# Altium schematic sheet Sayma_AMC.SchDoc: Sayma AMC
size 420 x 297 mm; $$Internal___BlkDate: 0:12:25_2-9-18; $$Internal_NAME_PLACEHOLDER: a3sheet; $$Internal_Resolution: 00001mm; $$NotCommonProperty_@NAME: Sayma_AMC; $$NotCommonProperty_@PRINTORDER: 1; $$NotCommonProperty_@SHEET: 1; $$NotCommonProperty_@SHEETTOTAL: 30; $$NotCommonProperty_FORWARD_PCB: 0; CmpIndex: 8; Drawing Author: G.Kasprowicz; Drawing Number: Sayma AMC; Drawing Project: AMC FMC Carrier Board; Drawing Revision: 2.0; SymIndex: 2141; CheckedBy: P.Kulik,T.Przywozki,W.Ruclo; Author: G.Kasprowicz; CompanyName: WUT ISE; DrawnBy: G.Kasprowicz; Organization: WUT ISE; Address1: PW ISE; Address2: Nowowiejska 15/19 00-665 Warsaw; Address3: gkasprow@gmail.com; DocumentNumber: 1; Revision: 2; SheetNumber: 1; SheetTotal: 32; ModifiedBy: -; CheckedDate: -; Title2: Top; DivGrp: WUT ISE; Designer: G.Kasprowicz; ModifiedDate: -; ProjectName: Sensor Box
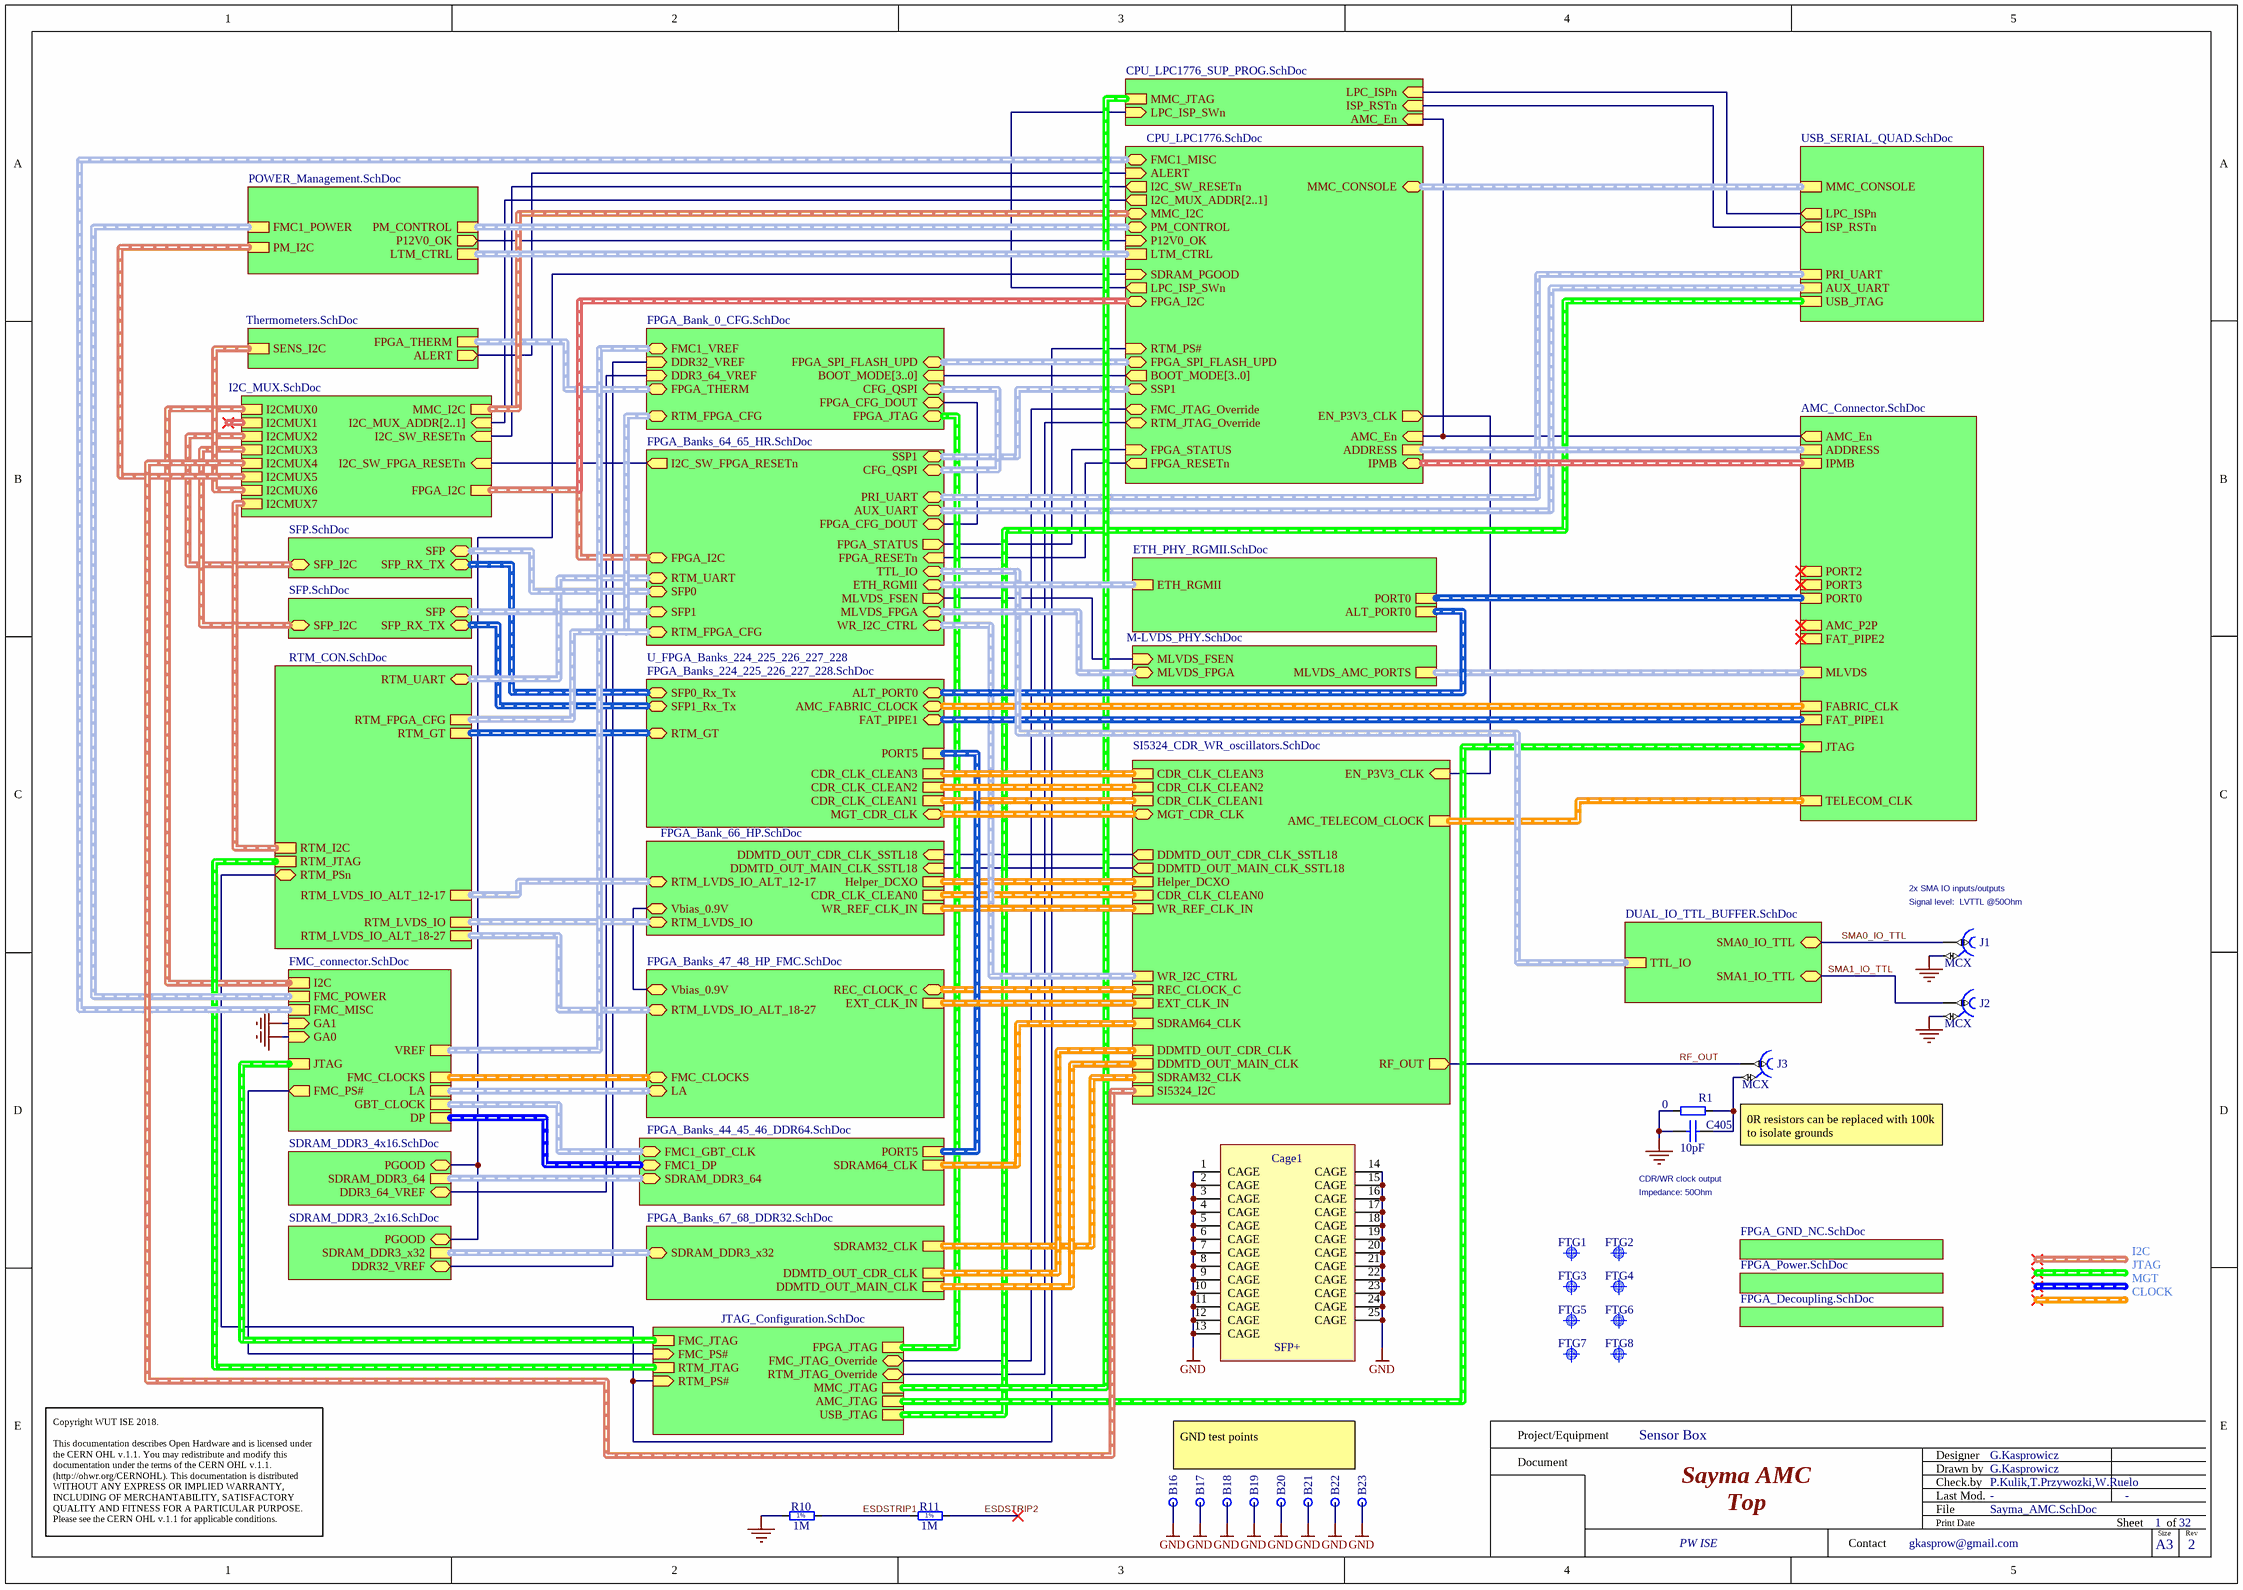
[diagram p0: Sayma_AMC.SchDoc]

## Parts
B16  Plated Hole  [c130h80]  (value not drawn)  (no BOM)
B17  Plated Hole  [c130h80]  (value not drawn)  (no BOM)
B18  Plated Hole  [c130h80]  (value not drawn)  (no BOM)
B19  Plated Hole  [c130h80]  (value not drawn)  (no BOM)
B20  Plated Hole  [c130h80]  (value not drawn)  (no BOM)
B21  Plated Hole  [c130h80]  (value not drawn)  (no BOM)
B22  Plated Hole  [c130h80]  (value not drawn)  (no BOM)
B23  Plated Hole  [c130h80]  (value not drawn)  (no BOM)
C405  10pF  [CAPC1608X87N]
Cage1  SFP+  [TYCO_2007263-1]
FTG1  Use only in PCB  [FIDUCIAL_TOP_C100-200]  (value not drawn)
FTG2  Use only in PCB  [FIDUCIAL_TOP_S100-200]  (value not drawn)
FTG3  Use only in PCB  [FIDUCIAL_TOP_C100-200]  (value not drawn)
FTG4  Use only in PCB  [FIDUCIAL_TOP_S100-200]  (value not drawn)
FTG5  Use only in PCB  [FIDUCIAL_TOP_C100-200]  (value not drawn)
FTG6  Use only in PCB  [FIDUCIAL_TOP_S100-200]  (value not drawn)
FTG7  Use only in PCB  [FIDUCIAL_TOP_C100-200]  (value not drawn)
FTG8  Use only in PCB  [FIDUCIAL_TOP_S100-200]  (value not drawn)
J1  MCX  [AMPHENOL_ARF2521-ND]
J2  MCX  [AMPHENOL_ARF2521-ND]
J3  MCX  [AMPHENOL_ARF2521-ND]
R1  0  [RESC1005X40N]
R10  1M  [RESC5025X65N]
R11  1M  [RESC5025X65N]

## Sub-sheets
AMC_Connector = AMC_Connector.SchDoc: ADDRESS (harness AMC_ADD), IPMB (harness I2C), PORT0 (harness MGTx1), FABRIC_CLK (harness AMC_FABRIC_CLOCK), TELECOM_CLK (harness AMC_TELECOM_CLOCK), AMC_P2P (harness AMC_P2P), FAT_PIPE1 (harness FAT_PIPE1), FAT_PIPE2 (harness FAT_PIPE2), MLVDS (harness MLVDS), JTAG (harness JTAG), PORT3 (harness PORT3), PORT2 (harness PORT2), AMC_En (out)  | $$NotCommonProperty_SHEETNAME: AMC_CON; CmpIndex: 1; Name: AMC_CON74792; SymIndex: 791
CPU_LPC1776 = CPU_LPC1776.SchDoc: RTM_PS# (in), ALERT (in), FMC1_MISC (bidir, harness FMC_MICS), FPGA_I2C (bidir, harness I2C), IPMB (bidir, harness I2C), FPGA_SPI_FLASH_UPD (bidir, harness FLASH_UPD), FPGA_RESETn (out), LPC_ISP_SWn (out), SDRAM_PGOOD (in), MMC_CONSOLE (bidir, harness UART), ADDRESS (harness AMC_ADD), MMC_I2C (bidir, harness I2C), AMC_En (in), PM_CONTROL (bidir, harness PM_CONTROL), I2C_SW_RESETn (out), I2C_MUX_ADDR[2..1] (out), P12V0_OK (in), BOOT_MODE[3..0] (out), FMC_JTAG_Override (bidir), RTM_JTAG_Override (bidir), SSP1 (bidir, harness SPI), FPGA_STATUS (in), LTM_CTRL (harness LTM_CTRL), EN_P3V3_CLK (out)  | CmpIndex: 54; Name: LPC17762984; SymIndex: 1756
DUAL_IO_TTL_BUFFER = DUAL_IO_TTL_BUFFER.SchDoc: SMA0_IO_TTL (bidir), SMA1_IO_TTL (bidir), TTL_IO (harness TTL_IO)  | CmpIndex: 71; Name: DUAL_IO_TTL_BUFFER; SymIndex: 1772
ETH_PHY_RGMII = ETH_PHY_RGMII.SchDoc: ETH_RGMII (harness RGMII), PORT0 (harness MGTx1), ALT_PORT0 (harness MGTx1)  | CmpIndex: 18; SymIndex: 1511
FMC_connector = FMC_connector.SchDoc: FMC_CLOCKS (harness FMC_CLOCKS), GBT_CLOCK (harness DIFF_CLK), VREF (harness FMC_VREF), JTAG (harness JTAG), GA0 (in), FMC_POWER (harness FMC_POWER), GA1 (in), LA (harness FMC_LA), DP (harness DP0), FMC_MISC (harness FMC_MICS), I2C (harness I2C), FMC_PS# (out)  | $$NotCommonProperty_SHEETNAME: HPC1; CmpIndex: 6; Name: FMC1; SymIndex: 792
I2C_MUX = I2C_MUX.SchDoc: FPGA_I2C (harness I2C), MMC_I2C (harness I2C), I2CMUX7 (harness I2C), I2CMUX6 (harness I2C), I2CMUX5 (harness I2C), I2CMUX3 (harness I2C), I2CMUX2 (harness I2C), I2CMUX1 (harness I2C), I2CMUX0 (harness I2C), I2C_SW_RESETn (in), I2CMUX4 (harness I2C), I2C_MUX_ADDR[2..1] (in), I2C_SW_FPGA_RESETn (in)  | CmpIndex: 23; Name: I2C_MUX; SymIndex: 1875
JTAG_Configuration = JTAG_Configuration.SchDoc: FMC_JTAG (harness JTAG), AMC_JTAG (harness JTAG), FPGA_JTAG (harness JTAG4), MMC_JTAG (harness JTAG), RTM_JTAG (harness JTAG4), USB_JTAG (harness USB_JTAG), FMC_PS# (in), RTM_PS# (in), RTM_JTAG_Override (bidir), FMC_JTAG_Override (bidir)  | $$NotCommonProperty_SHEETNAME: JTAG_CONF; CmpIndex: 3; Name: JTAG_CONF7; SymIndex: 798
M-LVDS_PHY = M-LVDS_PHY.SchDoc: MLVDS_AMC_PORTS (harness MLVDS), MLVDS_FPGA (bidir, harness MLVDS_FPGA), MLVDS_FSEN (in)  | $$NotCommonProperty_SHEETNAME: LVDS_PHY; CmpIndex: 29; Name: AMC_FMC_Carrier_LVDS_PHY762107; SymIndex: 800
POWER_Management = POWER_Management.SchDoc: FMC1_POWER (harness FMC_POWER), PM_CONTROL (harness PM_CONTROL), PM_I2C (harness I2C), P12V0_OK (out), LTM_CTRL (harness LTM_CTRL)  | $$NotCommonProperty_SHEETNAME: PWR_MGT; CmpIndex: 13; Name: PWR_MGT75095; SymIndex: 796
RTM_CON = RTM_CON.SchDoc: RTM_GT (harness RTM_GT), RTM_I2C (harness I2C), RTM_PSn (bidir), RTM_JTAG (harness JTAG4), RTM_FPGA_CFG (harness RTM_FPA_CFG), RTM_LVDS_IO (harness RTM_LVDS_IO), RTM_LVDS_IO_ALT_18-27 (harness RTM_LVDS_IO_ALT_18-27), RTM_LVDS_IO_ALT_12-17 (harness RTM_LVDS_IO_ALT_12-17), RTM_UART (bidir, harness UART)  | $$NotCommonProperty_SHEETNAME: RTM_CON; CmpIndex: 15; Name: RTM_CON; SymIndex: 799
SDRAM_DDR3_2x16 = SDRAM_DDR3_2x16.SchDoc: PGOOD (bidir), SDRAM_DDR3_x32 (harness DDR3_32), DDR32_VREF (bidir)  | CmpIndex: 9; SymIndex: 1420
SDRAM_DDR3_4x16 = SDRAM_DDR3_4x16.SchDoc: PGOOD (bidir), SDRAM_DDR3_64 (harness SDRAM_DDR3_64), DDR3_64_VREF (bidir)  | CmpIndex: 2; SymIndex: 276
SFP = SFP.SchDoc: SFP (bidir, harness SFP_CTL), SFP_RX_TX (bidir, harness SFP_MGT), SFP_I2C (bidir, harness I2C)  | CmpIndex: 17; SymIndex: 1422
SFP = SFP.SchDoc: SFP (bidir, harness SFP_CTL), SFP_RX_TX (bidir, harness SFP_MGT), SFP_I2C (bidir, harness I2C)  | CmpIndex: 17; SymIndex: 1422
SI5324_CDR_WR_oscillators = SI5324_CDR_WR_oscillators.SchDoc: CDR_CLK_CLEAN1 (harness DIFF_CLK), WR_REF_CLK_IN (harness DIFF_CLK), CDR_CLK_CLEAN0 (harness DIFF_CLK), Helper_DCXO (harness DIFF_CLK), REC_CLOCK_C (harness DIFF_CLK), AMC_TELECOM_CLOCK (harness AMC_TELECOM_CLOCK), WR_I2C_CTRL (harness WR_I2C_CTRL), SI5324_I2C (harness I2C), RF_OUT (out), SDRAM64_CLK (harness DIFF_CLK), SDRAM32_CLK (harness DIFF_CLK), CDR_CLK_CLEAN2 (harness DIFF_CLK), CDR_CLK_CLEAN3 (harness DIFF_CLK), MGT_CDR_CLK (bidir, harness DIFF_CLK), DDMTD_OUT_CDR_CLK (harness DIFF_CLK), DDMTD_OUT_MAIN_CLK (harness DIFF_CLK), EXT_CLK_IN (harness DIFF_CLK), DDMTD_OUT_CDR_CLK_SSTL18 (out), DDMTD_OUT_MAIN_CLK_SSTL18 (out), EN_P3V3_CLK (in)  | CmpIndex: 22; Name: Si5324 Clock recovery945991223; SymIndex: 1416
Thermometers = Thermometers.SchDoc: ALERT (out), FPGA_THERM (harness FPGA_THERM), SENS_I2C (harness I2C)  | $$NotCommonProperty_SHEETNAME: THERMO; CmpIndex: 44; Name: FMC_HPC2_THERMO; SymIndex: 789
U_CPU_LPC1776_SUP_PROG = CPU_LPC1776_SUP_PROG.SchDoc: LPC_ISPn (in), ISP_RSTn (in), LPC_ISP_SWn (in), MMC_JTAG (harness JTAG), AMC_En (in)
U_FPGA_Bank_0_CFG = FPGA_Bank_0_CFG.SchDoc: FMC1_VREF (bidir, harness FMC_VREF), FPGA_JTAG (bidir, harness JTAG4), BOOT_MODE[3..0] (in), FPGA_SPI_FLASH_UPD (bidir, harness FLASH_UPD), DDR32_VREF (in), DDR3_64_VREF (in), CFG_QSPI (bidir, harness CFG_QSPI), RTM_FPGA_CFG (bidir, harness RTM_FPA_CFG), FPGA_CFG_DOUT (bidir), FPGA_THERM (bidir, harness FPGA_THERM)
U_FPGA_Bank_66_HP = FPGA_Bank_66_HP.SchDoc: RTM_LVDS_IO_ALT_12-17 (bidir, harness RTM_LVDS_IO_ALT_12-17), RTM_LVDS_IO (bidir, harness RTM_LVDS_IO), Helper_DCXO (harness DIFF_CLK), CDR_CLK_CLEAN0 (harness DIFF_CLK), WR_REF_CLK_IN (harness DIFF_CLK), Vbias_0.9V (bidir), DDMTD_OUT_CDR_CLK_SSTL18 (in), DDMTD_OUT_MAIN_CLK_SSTL18 (in)
U_FPGA_Banks_44_45_46_DDR64 = FPGA_Banks_44_45_46_DDR64.SchDoc: FMC1_GBT_CLK (bidir, harness DIFF_CLK), FMC1_DP (bidir, harness DP0), SDRAM_DDR3_64 (bidir, harness SDRAM_DDR3_64), PORT5 (harness MGTx1), SDRAM64_CLK (harness DIFF_CLK)
U_FPGA_Banks_47_48_HP_FMC = FPGA_Banks_47_48_HP_FMC.SchDoc: RTM_LVDS_IO_ALT_18-27 (bidir, harness RTM_LVDS_IO_ALT_18-27), LA (bidir, harness FMC_LA), FMC_CLOCKS (bidir, harness FMC_CLOCKS), REC_CLOCK_C (bidir, harness DIFF_CLK), Vbias_0.9V (bidir), EXT_CLK_IN (harness DIFF_CLK)
U_FPGA_Banks_64_65_HR = FPGA_Banks_64_65_HR.SchDoc: SFP1 (bidir, harness SFP_CTL), SFP0 (bidir, harness SFP_CTL), FPGA_RESETn (in), MLVDS_FSEN (out), ETH_RGMII (bidir, harness RGMII), WR_I2C_CTRL (bidir, harness WR_I2C_CTRL), MLVDS_FPGA (bidir, harness MLVDS_FPGA), FPGA_I2C (bidir, harness I2C), FPGA_STATUS (out), SSP1 (bidir, harness SPI), CFG_QSPI (bidir, harness CFG_QSPI), RTM_FPGA_CFG (bidir, harness RTM_FPA_CFG), FPGA_CFG_DOUT (bidir), TTL_IO (bidir, harness TTL_IO), RTM_UART (bidir, harness UART), PRI_UART (bidir, harness UART), AUX_UART (bidir, harness UART), I2C_SW_FPGA_RESETn (out)
U_FPGA_Banks_67_68_DDR32 = FPGA_Banks_67_68_DDR32.SchDoc: SDRAM_DDR3_x32 (bidir, harness DDR3_32), SDRAM32_CLK (harness DIFF_CLK), DDMTD_OUT_CDR_CLK (harness DIFF_CLK), DDMTD_OUT_MAIN_CLK (harness DIFF_CLK)
U_FPGA_Banks_224_225_226_227_228 = FPGA_Banks_224_225_226_227_228.SchDoc: SFP0_Rx_Tx (bidir, harness SFP_MGT), SFP1_Rx_Tx (bidir, harness SFP_MGT), FAT_PIPE1 (bidir, harness FAT_PIPE1), AMC_FABRIC_CLOCK (bidir, harness AMC_FABRIC_CLOCK), ALT_PORT0 (bidir, harness MGTx1), RTM_GT (bidir, harness RTM_GT), CDR_CLK_CLEAN1 (harness DIFF_CLK), PORT5 (harness MGTx1), CDR_CLK_CLEAN2 (harness DIFF_CLK), CDR_CLK_CLEAN3 (harness DIFF_CLK), MGT_CDR_CLK (bidir, harness DIFF_CLK)
U_FPGA_Decoupling = FPGA_Decoupling.SchDoc: no entries
U_FPGA_GND_NC = FPGA_GND_NC.SchDoc: no entries
U_FPGA_Power = FPGA_Power.SchDoc: no entries
USB_SERIAL_QUAD = USB_SERIAL_QUAD.SchDoc: MMC_CONSOLE (harness UART), USB_JTAG (harness USB_JTAG), LPC_ISPn (out), PRI_UART (harness UART), ISP_RSTn (out), AUX_UART (harness UART)  | CmpIndex: 0; Name: USB_UART_QUAD856120; SymIndex: 807

## Nets
GND: B16.1 B17.1 B18.1 B19.1 B20.1 B21.1 B22.1 B23.1 C405.1 Cage1.1(CAGE) Cage1.2(CAGE) Cage1.3(CAGE) Cage1.4(CAGE) Cage1.5(CAGE) Cage1.6(CAGE) Cage1.7(CAGE) Cage1.8(CAGE) Cage1.9(CAGE) Cage1.10(CAGE) Cage1.11(CAGE) Cage1.12(CAGE) Cage1.13(CAGE) Cage1.14(CAGE) Cage1.15(CAGE) Cage1.16(CAGE) Cage1.17(CAGE) Cage1.18(CAGE) Cage1.19(CAGE) Cage1.20(CAGE) Cage1.21(CAGE) Cage1.22(CAGE) Cage1.23(CAGE) Cage1.24(CAGE) Cage1.25(CAGE) J1.2 J2.2 R1.2 R10.1 ; sheet FMC_connector/GA0, sheet FMC_connector/GA1
ESDSTRIP1: R10.2 R11.1
ESDSTRIP2: R11.2
RF_OUT: J3.1 ; sheet SI5324_CDR_WR_oscillators/RF_OUT
SMA0_IO_TTL: J1.1 ; sheet DUAL_IO_TTL_BUFFER/SMA0_IO_TTL
SMA1_IO_TTL: J2.1 ; sheet DUAL_IO_TTL_BUFFER/SMA1_IO_TTL
NetC405_2: C405.2 J3.2 R1.1
(unnamed): sheet USB_SERIAL_QUAD/LPC_ISPn, sheet U_CPU_LPC1776_SUP_PROG/LPC_ISPn
(unnamed): sheet USB_SERIAL_QUAD/ISP_RSTn, sheet U_CPU_LPC1776_SUP_PROG/ISP_RSTn
(unnamed): sheet AMC_Connector/AMC_En, sheet CPU_LPC1776/AMC_En, sheet U_CPU_LPC1776_SUP_PROG/AMC_En
(unnamed): sheet SDRAM_DDR3_4x16/PGOOD, sheet SDRAM_DDR3_2x16/PGOOD, sheet CPU_LPC1776/SDRAM_PGOOD
(unnamed): sheet SDRAM_DDR3_4x16/DDR3_64_VREF, sheet U_FPGA_Bank_0_CFG/DDR3_64_VREF
(unnamed): sheet JTAG_Configuration/FMC_PS#, sheet FMC_connector/FMC_PS#
(unnamed): sheet JTAG_Configuration/RTM_PS#, sheet RTM_CON/RTM_PSn, sheet CPU_LPC1776/RTM_PS#
(unnamed): sheet JTAG_Configuration/RTM_JTAG_Override, sheet CPU_LPC1776/RTM_JTAG_Override
(unnamed): sheet JTAG_Configuration/FMC_JTAG_Override, sheet CPU_LPC1776/FMC_JTAG_Override
(unnamed): sheet SDRAM_DDR3_2x16/DDR32_VREF, sheet U_FPGA_Bank_0_CFG/DDR32_VREF
(unnamed): sheet POWER_Management/P12V0_OK, sheet CPU_LPC1776/P12V0_OK
(unnamed): sheet SI5324_CDR_WR_oscillators/DDMTD_OUT_CDR_CLK_SSTL18, sheet U_FPGA_Bank_66_HP/DDMTD_OUT_CDR_CLK_SSTL18
(unnamed): sheet SI5324_CDR_WR_oscillators/DDMTD_OUT_MAIN_CLK_SSTL18, sheet U_FPGA_Bank_66_HP/DDMTD_OUT_MAIN_CLK_SSTL18
(unnamed): sheet SI5324_CDR_WR_oscillators/EN_P3V3_CLK, sheet CPU_LPC1776/EN_P3V3_CLK
(unnamed): sheet I2C_MUX/I2C_SW_RESETn, sheet CPU_LPC1776/I2C_SW_RESETn
(unnamed): sheet I2C_MUX/I2C_SW_FPGA_RESETn, sheet U_FPGA_Banks_64_65_HR/I2C_SW_FPGA_RESETn
(unnamed): sheet Thermometers/ALERT, sheet CPU_LPC1776/ALERT
(unnamed): sheet CPU_LPC1776/FPGA_RESETn, sheet U_FPGA_Banks_64_65_HR/FPGA_RESETn
(unnamed): sheet CPU_LPC1776/LPC_ISP_SWn, sheet U_CPU_LPC1776_SUP_PROG/LPC_ISP_SWn
(unnamed): sheet CPU_LPC1776/FPGA_STATUS, sheet U_FPGA_Banks_64_65_HR/FPGA_STATUS
(unnamed): sheet U_FPGA_Banks_47_48_HP_FMC/Vbias_0.9V, sheet U_FPGA_Bank_66_HP/Vbias_0.9V
(unnamed): sheet U_FPGA_Banks_64_65_HR/MLVDS_FSEN, sheet M-LVDS_PHY/MLVDS_FSEN
(unnamed): sheet U_FPGA_Banks_64_65_HR/FPGA_CFG_DOUT, sheet U_FPGA_Bank_0_CFG/FPGA_CFG_DOUT

## Buses and harness runs
bus sheet CPU_LPC1776/BOOT_MODE[3..0] = sheet U_FPGA_Bank_0_CFG/BOOT_MODE[3..0]
bus sheet CPU_LPC1776/I2C_MUX_ADDR[2..1] = sheet I2C_MUX/I2C_MUX_ADDR[2..1]
harness sheet AMC_Connector/ADDRESS = sheet CPU_LPC1776/ADDRESS
harness sheet AMC_Connector/FABRIC_CLK = sheet U_FPGA_Banks_224_225_226_227_228/AMC_FABRIC_CLOCK
harness sheet AMC_Connector/FAT_PIPE1 = sheet U_FPGA_Banks_224_225_226_227_228/FAT_PIPE1
harness sheet AMC_Connector/IPMB = sheet CPU_LPC1776/IPMB
harness sheet AMC_Connector/JTAG = sheet JTAG_Configuration/AMC_JTAG
harness sheet AMC_Connector/MLVDS = sheet M-LVDS_PHY/MLVDS_AMC_PORTS
harness sheet AMC_Connector/PORT0 = sheet ETH_PHY_RGMII/PORT0
harness sheet AMC_Connector/TELECOM_CLK = sheet SI5324_CDR_WR_oscillators/AMC_TELECOM_CLOCK
harness sheet CPU_LPC1776/FMC1_MISC = sheet FMC_connector/FMC_MISC
harness sheet CPU_LPC1776/FPGA_I2C = sheet I2C_MUX/FPGA_I2C = sheet U_FPGA_Banks_64_65_HR/FPGA_I2C
harness sheet CPU_LPC1776/FPGA_SPI_FLASH_UPD = sheet U_FPGA_Bank_0_CFG/FPGA_SPI_FLASH_UPD
harness sheet CPU_LPC1776/LTM_CTRL = sheet POWER_Management/LTM_CTRL
harness sheet CPU_LPC1776/MMC_CONSOLE = sheet USB_SERIAL_QUAD/MMC_CONSOLE
harness sheet CPU_LPC1776/MMC_I2C = sheet I2C_MUX/MMC_I2C
harness sheet CPU_LPC1776/PM_CONTROL = sheet POWER_Management/PM_CONTROL
harness sheet CPU_LPC1776/SSP1 = sheet U_FPGA_Banks_64_65_HR/SSP1
harness sheet DUAL_IO_TTL_BUFFER/TTL_IO = sheet U_FPGA_Banks_64_65_HR/TTL_IO
harness sheet ETH_PHY_RGMII/ALT_PORT0 = sheet U_FPGA_Banks_224_225_226_227_228/ALT_PORT0
harness sheet ETH_PHY_RGMII/ETH_RGMII = sheet U_FPGA_Banks_64_65_HR/ETH_RGMII
harness sheet FMC_connector/DP = sheet U_FPGA_Banks_44_45_46_DDR64/FMC1_DP
harness sheet FMC_connector/FMC_CLOCKS = sheet U_FPGA_Banks_47_48_HP_FMC/FMC_CLOCKS
harness sheet FMC_connector/FMC_POWER = sheet POWER_Management/FMC1_POWER
harness sheet FMC_connector/GBT_CLOCK = sheet U_FPGA_Banks_44_45_46_DDR64/FMC1_GBT_CLK
harness sheet FMC_connector/I2C = sheet I2C_MUX/I2CMUX0
harness sheet FMC_connector/JTAG = sheet JTAG_Configuration/FMC_JTAG
harness sheet FMC_connector/LA = sheet U_FPGA_Banks_47_48_HP_FMC/LA
harness sheet FMC_connector/VREF = sheet U_FPGA_Bank_0_CFG/FMC1_VREF
harness sheet I2C_MUX/I2CMUX2 = sheet SFP/SFP_I2C
harness sheet I2C_MUX/I2CMUX3 = sheet SFP/SFP_I2C
harness sheet I2C_MUX/I2CMUX4 = sheet SI5324_CDR_WR_oscillators/SI5324_I2C
harness sheet I2C_MUX/I2CMUX5 = sheet POWER_Management/PM_I2C
harness sheet I2C_MUX/I2CMUX6 = sheet Thermometers/SENS_I2C
harness sheet I2C_MUX/I2CMUX7 = sheet RTM_CON/RTM_I2C
harness sheet JTAG_Configuration/FPGA_JTAG = sheet U_FPGA_Bank_0_CFG/FPGA_JTAG
harness sheet JTAG_Configuration/MMC_JTAG = sheet U_CPU_LPC1776_SUP_PROG/MMC_JTAG
harness sheet JTAG_Configuration/RTM_JTAG = sheet RTM_CON/RTM_JTAG
harness sheet JTAG_Configuration/USB_JTAG = sheet USB_SERIAL_QUAD/USB_JTAG
harness sheet M-LVDS_PHY/MLVDS_FPGA = sheet U_FPGA_Banks_64_65_HR/MLVDS_FPGA
harness sheet RTM_CON/RTM_FPGA_CFG = sheet U_FPGA_Bank_0_CFG/RTM_FPGA_CFG = sheet U_FPGA_Banks_64_65_HR/RTM_FPGA_CFG
harness sheet RTM_CON/RTM_GT = sheet U_FPGA_Banks_224_225_226_227_228/RTM_GT
harness sheet RTM_CON/RTM_LVDS_IO = sheet U_FPGA_Bank_66_HP/RTM_LVDS_IO
harness sheet RTM_CON/RTM_LVDS_IO_ALT_12-17 = sheet U_FPGA_Bank_66_HP/RTM_LVDS_IO_ALT_12-17
harness sheet RTM_CON/RTM_LVDS_IO_ALT_18-27 = sheet U_FPGA_Banks_47_48_HP_FMC/RTM_LVDS_IO_ALT_18-27
harness sheet RTM_CON/RTM_UART = sheet U_FPGA_Banks_64_65_HR/RTM_UART
harness sheet SDRAM_DDR3_2x16/SDRAM_DDR3_x32 = sheet U_FPGA_Banks_67_68_DDR32/SDRAM_DDR3_x32
harness sheet SDRAM_DDR3_4x16/SDRAM_DDR3_64 = sheet U_FPGA_Banks_44_45_46_DDR64/SDRAM_DDR3_64
harness sheet SFP/SFP = sheet U_FPGA_Banks_64_65_HR/SFP0
harness sheet SFP/SFP = sheet U_FPGA_Banks_64_65_HR/SFP1
harness sheet SFP/SFP_RX_TX = sheet U_FPGA_Banks_224_225_226_227_228/SFP0_Rx_Tx
harness sheet SFP/SFP_RX_TX = sheet U_FPGA_Banks_224_225_226_227_228/SFP1_Rx_Tx
harness sheet SI5324_CDR_WR_oscillators/CDR_CLK_CLEAN0 = sheet U_FPGA_Bank_66_HP/CDR_CLK_CLEAN0
harness sheet SI5324_CDR_WR_oscillators/CDR_CLK_CLEAN1 = sheet U_FPGA_Banks_224_225_226_227_228/CDR_CLK_CLEAN1
harness sheet SI5324_CDR_WR_oscillators/CDR_CLK_CLEAN2 = sheet U_FPGA_Banks_224_225_226_227_228/CDR_CLK_CLEAN2
harness sheet SI5324_CDR_WR_oscillators/CDR_CLK_CLEAN3 = sheet U_FPGA_Banks_224_225_226_227_228/CDR_CLK_CLEAN3
harness sheet SI5324_CDR_WR_oscillators/DDMTD_OUT_CDR_CLK = sheet U_FPGA_Banks_67_68_DDR32/DDMTD_OUT_CDR_CLK
harness sheet SI5324_CDR_WR_oscillators/DDMTD_OUT_MAIN_CLK = sheet U_FPGA_Banks_67_68_DDR32/DDMTD_OUT_MAIN_CLK
harness sheet SI5324_CDR_WR_oscillators/EXT_CLK_IN = sheet U_FPGA_Banks_47_48_HP_FMC/EXT_CLK_IN
harness sheet SI5324_CDR_WR_oscillators/Helper_DCXO = sheet U_FPGA_Bank_66_HP/Helper_DCXO
harness sheet SI5324_CDR_WR_oscillators/MGT_CDR_CLK = sheet U_FPGA_Banks_224_225_226_227_228/MGT_CDR_CLK
harness sheet SI5324_CDR_WR_oscillators/REC_CLOCK_C = sheet U_FPGA_Banks_47_48_HP_FMC/REC_CLOCK_C
harness sheet SI5324_CDR_WR_oscillators/SDRAM32_CLK = sheet U_FPGA_Banks_67_68_DDR32/SDRAM32_CLK
harness sheet SI5324_CDR_WR_oscillators/SDRAM64_CLK = sheet U_FPGA_Banks_44_45_46_DDR64/SDRAM64_CLK
harness sheet SI5324_CDR_WR_oscillators/WR_I2C_CTRL = sheet U_FPGA_Banks_64_65_HR/WR_I2C_CTRL
harness sheet SI5324_CDR_WR_oscillators/WR_REF_CLK_IN = sheet U_FPGA_Bank_66_HP/WR_REF_CLK_IN
harness sheet Thermometers/FPGA_THERM = sheet U_FPGA_Bank_0_CFG/FPGA_THERM
harness sheet U_FPGA_Bank_0_CFG/CFG_QSPI = sheet U_FPGA_Banks_64_65_HR/CFG_QSPI
harness sheet U_FPGA_Banks_44_45_46_DDR64/PORT5 = sheet U_FPGA_Banks_224_225_226_227_228/PORT5
harness sheet U_FPGA_Banks_64_65_HR/AUX_UART = sheet USB_SERIAL_QUAD/AUX_UART
harness sheet U_FPGA_Banks_64_65_HR/PRI_UART = sheet USB_SERIAL_QUAD/PRI_UART

## Notes on the sheet
- (near J1) Signal level:  LVTTL @50Ohm
- (near J1) 2x SMA IO inputs/outputs
- CDR/WR clock output
- Impedance: 50Ohm
- 0R resistors can be replaced with 100k to isolate grounds
- I2C
- JTAG
- MGT
- CLOCK
- GND test points
- Project/Equipment
- Document
- Designer
- Drawn by
- Check.by
- Copyright WUT ISE 2018.
  This documentation describes Open Hardware and is licensed under the CERN OHL v.1.1. You may redistribute and modify this documentation under the terms of the CERN OHL v.1.1. (http://ohwr.org/CERNOHL). This documentation is distributed WITHOUT ANY EXPRESS OR IMPLIED WARRANTY, INCLUDING OF MERCHANTABILITY, SATISFACTORY QUALITY AND FITNESS FOR A PARTICULAR PURPOSE. Please see the CERN OHL v.1.1 for applicable conditions.
- Contact
- File
- Last Mod.
- Print Date
- Sheet
- Size
- A3
- of
- Rev
- (in symbol R2010_1M_1%_0.5W_200PPM) 1%

## Library data of the parts
B16-B23 = PLATED_HOLE0.8_PAD1.3: Single Terminal Socket; Part Description: Plated Through Hole: Hole Dia.=0.8mm Pad Dia.=1.3mm, IPC-7251 Level C; Mounted: No; Part Number: PLATED_HOLE0.8_PAD1.3; Component Type: Standard (No BOM); Pin Count: 1; Family: Plated Hole; Socket: No; SMD: No; Sense: No; Status: None; ComponentHeight: 0mm; HelpURL: Undefined; Author: CERN DEM JLC; CreateDate: 30.10.2008; LatestRevisionDate: 30.10.2008; PackageDescription: Plated Through Hole: Hole Dia.=0.8mm Pad Dia.=1.3mm, IPC-7251 Level C
C405 = CC0603_10PF_50V_5%_NP0: Non-polarised capacitor; Manufacturer: GENERIC; Part Description: SMD Multilayer Chip Ceramic Capacitor; Manufacturer1 Part Number: 223886715109; Tolerance: ±5%; Voltage: 50V; TC: C0G/NP0; Manufacturer Part Number: CC0603_10PF_50V_5%_NP0; Part Number: CC0603_10PF_50V_5%_NP0; Value: 10pF; Component Kind: Standard; Component Type: Standard; Pin Count: 2; Status: Preferred; Case: 0603; Mounted: Yes; Socket: No; SMD: Yes; Sense: No; Manufacturer1 Example: PHYCOMP; Manufacturer1 ComponentHeight: 0.87mm; HelpURL: \\cern.ch\dfs\Applications\Altium\Datasheets\CC0603_NP0_PHYCOMP.pdf; Author: CERN DEM JLC; CreateDate: 03.12.2007; LatestRevisionDate: 03.12.2007
Cage1 = TYCO_2007263-1: SFP 1x2 Cage (25Pins); Part Description: 1x2 Press Fit SFP+ Cage with EMI Springs; Manufacturer: TYCO ELECTRONICS; Part Number: TYCO_2007263-1; Component Kind: Standard; Component Type: Standard; Pin Count: 25; Family: SFP+; Mounted: Yes; Socket: No; SMD: No; PressFit: Yes; Sense: No; Status: None; Manufacturer Part Number: 2007263-1; ComponentHeight: 9.7mm; HelpURL: \\cern.ch\dfs\Applications\Altium\Datasheets\TYCO_2007263-1.pdf; Author: CERN DEM JLC; CreateDate: 18.01.2017; LatestRevisionDate: 18.01.2017
FTG1 FTG3 FTG5 FTG7 = FIDUCIAL_TARGET_C100-200: Fiducial Target; Part Description: Round Fiducial Target, Top Layer, 1.0mm, Top Solder 2.0mm, Keepout =2.0mm; Mounted: No; Part Number: FIDUCIAL_TARGET_C100-200; Component Kind: Standard (No BOM); Component Type: Standard (No BOM); Pin Count: 1; Family: Fiducial; Socket: No; SMD: Yes; Sense: No; Status: None; ComponentHeight: 0mm; HelpURL: Undefined; Author: CERN DEM JLC; CreateDate: 09.02.2010; LatestRevisionDate: 04.04.2012; PackageDescription: Round Fiducial Target, Top Layer, 1.0mm, Top Solder 2.0mm, Keepout =2.0mm
FTG2 FTG4 FTG6 FTG8 = FIDUCIAL_TARGET_S100-200: Fiducial Target; Part Description: Square Fiducial Target, Top Layer, 1.0mm, Top Solder 2.0mm, Keepout =2.0mm; Mounted: No; Part Number: FIDUCIAL_TARGET_S100-200; Component Kind: Standard (No BOM); Component Type: Standard (No BOM); Pin Count: 1; Family: Fiducial; Socket: No; SMD: Yes; Sense: No; Status: None; ComponentHeight: 0mm; HelpURL: Undefined; Author: CERN DEM JLC; CreateDate: 09.02.2010; LatestRevisionDate: 04.04.2012; PackageDescription: Square Fiducial Target, Top Layer, 1.0mm, Top Solder 2.0mm, Keepout =2.0mm
J1-J3 = CON_MCX: Part Description: 50 Ohms MCX Right Angle PCB Receptacle (Jack); Manufacturer: AMPHENOL; PressFit: No; Part Number: AMPHENOL_ARF2521-ND; Component Kind: Standard; Component Type: Standard; Pin Count: 2; Family: MCX; Mounted: Yes; Socket: No; SMD: No; Sense: No; Status: None; Manufacturer Part Number: AMPHENOL_ARF2521-ND; ComponentHeight: 6; HelpURL: \\cern.ch\dfs\Applications\Altium\Datasheets\AMPHENOL_34-1030-12G.pdf; Author: GK; CreateDate: 21.02.2017; LatestRevisionDate: 21.02.2017
R1 = R0402_0R_JUMPER: Resistor; Manufacturer: GENERIC; Part Description: 1A (0.05R Max DC Resistance) Zero Ohm Jumper; Manufacturer1 Part Number: 232270591001L; PressFit: No; Manufacturer Part Number: R0402_0R_JUMPER; Part Number: R0402_0R_JUMPER; Value: 0; Component Kind: Standard; Component Type: Standard; Pin Count: 2; Status: Not Recommended; Case: 0402; Mounted: Yes; Sense: No; Socket: No; SMD: Yes; Manufacturer1 Example: YAGEO PHYCOMP; Manufacturer1 ComponentHeight: 0.4mm; HelpURL: \\cern.ch\dfs\Applications\Altium\Datasheets\R0402_Phycomp_RC0402.pdf; Author: CERN DEM JLC; CreateDate: 03.12.2007; LatestRevisionDate: 17.10.2012
R10 R11 = R2010_1M_1%_0.5W_200PPM: Resistor - 1%; Manufacturer: GENERIC; Part Description: Thick Film Chip Resistor; Manufacturer1 Part Number: LHVC2010-1MFT4; Power: 0.5W; TC: ±200ppm/°C; PressFit: No; Manufacturer Part Number: R2010_1M_1%_0.5W_200PPM; Part Number: R2010_1M_1%_0.5W_200PPM; Tolerance: ±1%; Value: 1M; Component Kind: Standard; Component Type: Standard; Pin Count: 2; Status: None; Case: 2010; Mounted: Yes; Sense: No; Socket: No; SMD: Yes; Manufacturer1 Example: TT WELWYN; Manufacturer1 ComponentHeight: 0.65mm; HelpURL: \\cern.ch\dfs\Applications\Altium\Datasheets\R2010_WELWYN_LHVC.pdf; Author: CERN DEM JLC; CreateDate: 26.02.2015; LatestRevisionDate: 26.02.2015